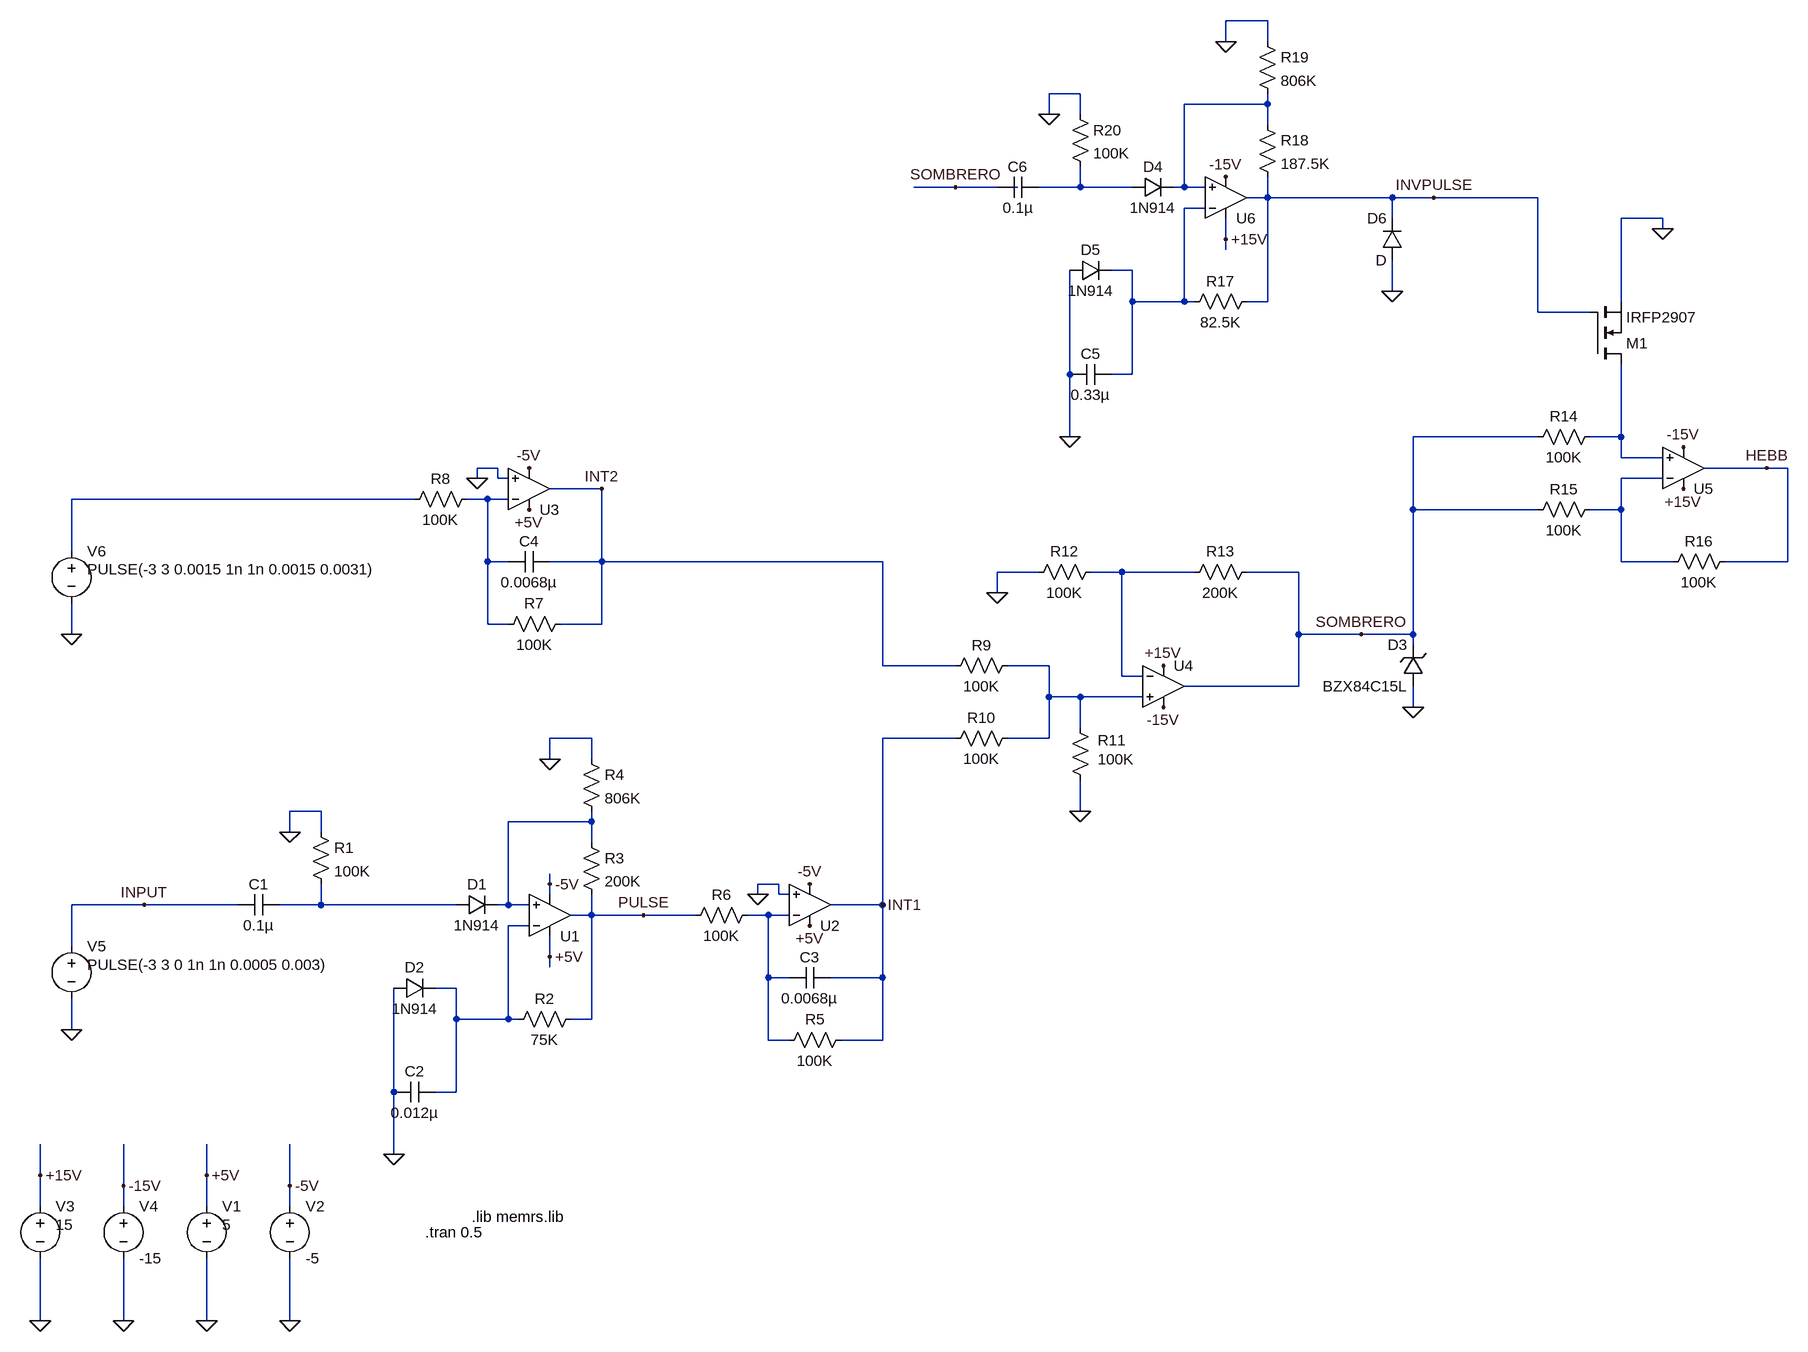
[diagram p0: schematic Main_sch.asc]
Main_sch.asc, the LTspice schematic file:
Version 4
SHEET 1 2292 680
WIRE 1472 -1888 1408 -1888
WIRE 1408 -1856 1408 -1888
WIRE 1472 -1856 1472 -1888
WIRE 1184 -1776 1136 -1776
WIRE 1472 -1760 1472 -1776
WIRE 1472 -1760 1344 -1760
WIRE 1136 -1744 1136 -1776
WIRE 1184 -1744 1184 -1776
WIRE 1472 -1728 1472 -1760
WIRE 992 -1632 928 -1632
WIRE 1056 -1632 992 -1632
WIRE 1088 -1632 1072 -1632
WIRE 1184 -1632 1184 -1664
WIRE 1184 -1632 1120 -1632
WIRE 1264 -1632 1184 -1632
WIRE 1344 -1632 1344 -1760
WIRE 1344 -1632 1328 -1632
WIRE 1376 -1632 1344 -1632
WIRE 1472 -1616 1472 -1648
WIRE 1472 -1616 1440 -1616
WIRE 1664 -1616 1472 -1616
WIRE 1728 -1616 1664 -1616
WIRE 1888 -1616 1728 -1616
WIRE 1376 -1600 1344 -1600
WIRE 1664 -1584 1664 -1616
WIRE 2080 -1584 2016 -1584
WIRE 2080 -1568 2080 -1584
WIRE 1408 -1552 1408 -1584
WIRE 1408 -1536 1408 -1552
WIRE 1264 -1504 1232 -1504
WIRE 1664 -1472 1664 -1520
WIRE 1264 -1456 1264 -1504
WIRE 1344 -1456 1344 -1600
WIRE 1344 -1456 1264 -1456
WIRE 1360 -1456 1344 -1456
WIRE 1472 -1456 1472 -1616
WIRE 1472 -1456 1440 -1456
WIRE 2016 -1456 2016 -1584
WIRE 1888 -1440 1888 -1616
WIRE 1968 -1440 1888 -1440
WIRE 1168 -1344 1168 -1504
WIRE 1264 -1344 1264 -1456
WIRE 1264 -1344 1232 -1344
WIRE 1168 -1248 1168 -1344
WIRE 1888 -1248 1696 -1248
WIRE 2016 -1248 2016 -1360
WIRE 2016 -1248 1968 -1248
WIRE 2016 -1216 2016 -1248
WIRE 2080 -1216 2016 -1216
WIRE 288 -1200 256 -1200
WIRE 2240 -1200 2144 -1200
WIRE 2272 -1200 2240 -1200
WIRE 256 -1184 256 -1200
WIRE 288 -1184 288 -1200
WIRE 304 -1184 288 -1184
WIRE 2080 -1184 2016 -1184
WIRE 448 -1168 368 -1168
WIRE 160 -1152 -368 -1152
WIRE 272 -1152 240 -1152
WIRE 304 -1152 272 -1152
WIRE 1696 -1136 1696 -1248
WIRE 1888 -1136 1696 -1136
WIRE 2016 -1136 2016 -1184
WIRE 2016 -1136 1968 -1136
WIRE -368 -1072 -368 -1152
WIRE 272 -1056 272 -1152
WIRE 304 -1056 272 -1056
WIRE 448 -1056 448 -1168
WIRE 448 -1056 368 -1056
WIRE 880 -1056 448 -1056
WIRE 2016 -1056 2016 -1136
WIRE 2096 -1056 2016 -1056
WIRE 2272 -1056 2272 -1200
WIRE 2272 -1056 2176 -1056
WIRE 1120 -1040 1056 -1040
WIRE 1248 -1040 1200 -1040
WIRE 1360 -1040 1248 -1040
WIRE 1520 -1040 1440 -1040
WIRE 1056 -1008 1056 -1040
WIRE 272 -960 272 -1056
WIRE 304 -960 272 -960
WIRE 448 -960 448 -1056
WIRE 448 -960 384 -960
WIRE -368 -944 -368 -992
WIRE 1520 -944 1520 -1040
WIRE 1616 -944 1520 -944
WIRE 1696 -944 1696 -1136
WIRE 1696 -944 1616 -944
WIRE 1696 -928 1696 -944
WIRE 880 -896 880 -1056
WIRE 992 -896 880 -896
WIRE 1136 -896 1072 -896
WIRE 1248 -880 1248 -1040
WIRE 1280 -880 1248 -880
WIRE 1520 -864 1520 -944
WIRE 1520 -864 1344 -864
WIRE 1136 -848 1136 -896
WIRE 1184 -848 1136 -848
WIRE 1280 -848 1184 -848
WIRE 1696 -832 1696 -864
WIRE 1184 -800 1184 -848
WIRE 432 -784 368 -784
WIRE 992 -784 880 -784
WIRE 1136 -784 1136 -848
WIRE 1136 -784 1072 -784
WIRE 368 -752 368 -784
WIRE 432 -752 432 -784
WIRE 16 -672 -32 -672
WIRE 1184 -672 1184 -720
WIRE 432 -656 432 -672
WIRE 432 -656 304 -656
WIRE -32 -640 -32 -672
WIRE 16 -640 16 -672
WIRE 432 -624 432 -656
WIRE 368 -560 368 -576
WIRE 720 -560 688 -560
WIRE 368 -544 368 -560
WIRE 688 -544 688 -560
WIRE 720 -544 720 -560
WIRE 736 -544 720 -544
WIRE -256 -528 -368 -528
WIRE -112 -528 -256 -528
WIRE 16 -528 16 -560
WIRE 16 -528 -48 -528
WIRE 224 -528 16 -528
WIRE 304 -528 304 -656
WIRE 304 -528 288 -528
WIRE 336 -528 304 -528
WIRE 880 -528 880 -784
WIRE 880 -528 800 -528
WIRE 432 -512 432 -544
WIRE 432 -512 400 -512
WIRE 512 -512 432 -512
WIRE 592 -512 512 -512
WIRE 704 -512 672 -512
WIRE 736 -512 704 -512
WIRE 336 -496 304 -496
WIRE -368 -464 -368 -528
WIRE 368 -448 368 -480
WIRE 368 -432 368 -448
WIRE 704 -416 704 -512
WIRE 736 -416 704 -416
WIRE 880 -416 880 -528
WIRE 880 -416 800 -416
WIRE 224 -400 192 -400
WIRE 224 -352 224 -400
WIRE 304 -352 304 -496
WIRE 304 -352 224 -352
WIRE 320 -352 304 -352
WIRE 432 -352 432 -512
WIRE 432 -352 400 -352
WIRE -368 -336 -368 -384
WIRE 704 -320 704 -416
WIRE 736 -320 704 -320
WIRE 880 -320 880 -416
WIRE 880 -320 816 -320
WIRE 128 -240 128 -400
WIRE 224 -240 224 -352
WIRE 224 -240 192 -240
WIRE 128 -144 128 -240
WIRE -416 -112 -416 -160
WIRE -160 -112 -160 -160
WIRE -288 -96 -288 -160
WIRE -32 -96 -32 -160
WIRE -416 -64 -416 -112
WIRE -288 -64 -288 -96
WIRE -160 -64 -160 -112
WIRE -32 -64 -32 -96
WIRE -416 112 -416 16
WIRE -288 112 -288 16
WIRE -160 112 -160 16
WIRE -32 112 -32 16
FLAG -160 112 0
FLAG -160 -112 +5V
FLAG -32 -96 -5V
FLAG -32 112 0
FLAG 368 -448 +5V
FLAG 368 -560 -5V
FLAG 368 -752 0
FLAG 128 -144 0
FLAG -32 -640 0
FLAG 768 -560 -5V
FLAG 768 -496 +5V
FLAG 688 -544 0
FLAG 880 -528 INT1
FLAG 512 -512 PULSE
FLAG 336 -1200 -5V
FLAG 336 -1136 +5V
FLAG 256 -1184 0
FLAG 448 -1168 INT2
FLAG -416 112 0
FLAG -416 -112 +15V
FLAG -288 -96 -15V
FLAG -288 112 0
FLAG -368 -336 0
FLAG -368 -944 0
FLAG -256 -528 INPUT
FLAG 1312 -832 -15V
FLAG 1312 -896 +15V
FLAG 1184 -672 0
FLAG 1056 -1008 0
FLAG 1616 -944 SOMBRERO
FLAG 1696 -832 0
FLAG 2112 -1232 -15V
FLAG 2112 -1168 +15V
FLAG 2080 -1568 0
FLAG 2240 -1200 HEBB
FLAG 1408 -1552 +15V
FLAG 1408 -1856 0
FLAG 1168 -1248 0
FLAG 992 -1632 SOMBRERO
FLAG 1136 -1744 0
FLAG 1408 -1648 -15V
FLAG 1728 -1616 INVPULSE
FLAG 1664 -1472 0
SYMBOL voltage -160 -80 R0
WINDOW 3 24 44 Left 2
WINDOW 123 0 0 Left 2
WINDOW 39 0 0 Left 2
SYMATTR Value 5
SYMATTR InstName V1
SYMBOL voltage -32 -80 R0
WINDOW 123 0 0 Left 2
WINDOW 39 0 0 Left 2
SYMATTR InstName V2
SYMATTR Value -5
SYMBOL Opamps\\UniversalOpamp2 368 -512 M180
SYMATTR InstName U1
SYMBOL cap -48 -544 R90
WINDOW 0 0 32 VBottom 2
WINDOW 3 32 32 VTop 2
SYMATTR InstName C1
SYMATTR Value 0.1µ
SYMATTR SpiceLine V=25 Irms=0 Rser=0.017282 Lser=350p mfg="Würth Elektronik" pn="885012207072 WCAP-CSGP 0805" type="X7R"
SYMBOL cap 192 -256 R90
WINDOW 0 0 32 VBottom 2
WINDOW 3 32 32 VTop 2
SYMATTR InstName C2
SYMATTR Value 0.012µ
SYMATTR SpiceLine V=25 Irms=332m Rser=0.302696 Lser=0 mfg="KEMET" pn="C0805F123K3RAC" type="X7R"
SYMBOL res 0 -656 R0
SYMATTR InstName R1
SYMATTR Value 100K
SYMATTR SpiceLine tol=1 pwr=0.1
SYMBOL res 416 -368 R90
WINDOW 0 0 56 VBottom 2
WINDOW 3 32 56 VTop 2
SYMATTR InstName R2
SYMATTR Value 75K
SYMATTR SpiceLine tol=1 pwr=0.1
SYMBOL res 416 -640 R0
SYMATTR InstName R3
SYMATTR Value 200K
SYMATTR SpiceLine tol=1 pwr=0.1
SYMBOL res 416 -768 R0
SYMATTR InstName R4
SYMATTR Value 806K
SYMATTR SpiceLine tol=1 pwr=0.1
SYMBOL diode 224 -512 R270
WINDOW 0 32 32 VTop 2
WINDOW 3 0 32 VBottom 2
SYMATTR InstName D1
SYMATTR Value 1N914
SYMBOL diode 128 -384 R270
WINDOW 0 32 32 VTop 2
WINDOW 3 0 32 VBottom 2
SYMATTR InstName D2
SYMATTR Value 1N914
SYMBOL Opamps\\UniversalOpamp2 768 -528 M180
SYMATTR InstName U2
SYMBOL cap 800 -432 R90
WINDOW 0 0 32 VBottom 2
WINDOW 3 32 32 VTop 2
SYMATTR InstName C3
SYMATTR Value 0.0068µ
SYMATTR SpiceLine V=25 Irms=0 Rser=0.0165691 Lser=256.21p mfg="Würth Elektronik" pn="885012009005 WCAP-CSGP 1210" type="NP0"
SYMBOL res 832 -336 R90
WINDOW 0 0 56 VBottom 2
WINDOW 3 32 56 VTop 2
SYMATTR InstName R5
SYMATTR Value 100K
SYMATTR SpiceLine tol=1 pwr=0.1
SYMBOL res 688 -528 R90
WINDOW 0 0 56 VBottom 2
WINDOW 3 32 56 VTop 2
SYMATTR InstName R6
SYMATTR Value 100K
SYMATTR SpiceLine tol=1 pwr=0.1
SYMBOL Opamps\\UniversalOpamp2 336 -1168 M180
SYMATTR InstName U3
SYMBOL cap 368 -1072 R90
WINDOW 0 0 32 VBottom 2
WINDOW 3 32 32 VTop 2
SYMATTR InstName C4
SYMATTR Value 0.0068µ
SYMATTR SpiceLine V=25 Irms=0 Rser=0.0165691 Lser=256.21p mfg="Würth Elektronik" pn="885012009005 WCAP-CSGP 1210" type="NP0"
SYMBOL res 400 -976 R90
WINDOW 0 0 56 VBottom 2
WINDOW 3 32 56 VTop 2
SYMATTR InstName R7
SYMATTR Value 100K
SYMATTR SpiceLine tol=1 pwr=0.1
SYMBOL res 256 -1168 R90
WINDOW 0 0 56 VBottom 2
WINDOW 3 32 56 VTop 2
SYMATTR InstName R8
SYMATTR Value 100K
SYMATTR SpiceLine tol=1 pwr=0.1
SYMBOL voltage -416 -80 R0
WINDOW 3 24 44 Left 2
WINDOW 123 0 0 Left 2
WINDOW 39 0 0 Left 2
SYMATTR Value 15
SYMATTR InstName V3
SYMBOL voltage -288 -80 R0
WINDOW 123 0 0 Left 2
WINDOW 39 0 0 Left 2
SYMATTR InstName V4
SYMATTR Value -15
SYMBOL voltage -368 -480 R0
WINDOW 3 24 44 Left 2
WINDOW 123 0 0 Left 2
WINDOW 39 0 0 Left 2
SYMATTR Value PULSE(-3 3 0 1n 1n 0.0005 0.003)
SYMATTR InstName V5
SYMBOL voltage -368 -1088 R0
WINDOW 3 24 44 Left 2
WINDOW 123 0 0 Left 2
WINDOW 39 0 0 Left 2
SYMATTR Value PULSE(-3 3 0.0015 1n 1n 0.0015 0.0031)
SYMATTR InstName V6
SYMBOL Opamps\\UniversalOpamp2 1312 -864 R0
SYMATTR InstName U4
SYMBOL res 1088 -912 R90
WINDOW 0 0 56 VBottom 2
WINDOW 3 32 56 VTop 2
SYMATTR InstName R9
SYMATTR Value 100K
SYMATTR SpiceLine tol=1 pwr=0.1
SYMBOL res 1088 -800 R90
WINDOW 0 0 56 VBottom 2
WINDOW 3 32 56 VTop 2
SYMATTR InstName R10
SYMATTR Value 100K
SYMATTR SpiceLine tol=1 pwr=0.1
SYMBOL res 1200 -704 R180
WINDOW 0 -55 77 Left 2
WINDOW 3 -67 48 Left 2
SYMATTR InstName R11
SYMATTR Value 100K
SYMATTR SpiceLine tol=1 pwr=0.1
SYMBOL res 1104 -1024 R270
WINDOW 0 32 56 VTop 2
WINDOW 3 0 56 VBottom 2
SYMATTR InstName R12
SYMATTR Value 100K
SYMATTR SpiceLine tol=1 pwr=0.1
SYMBOL res 1344 -1024 R270
WINDOW 0 32 56 VTop 2
WINDOW 3 0 56 VBottom 2
SYMATTR InstName R13
SYMATTR Value 200K
SYMATTR SpiceLine tol=1 pwr=0.1
SYMBOL zener 1712 -864 R180
WINDOW 0 24 64 Left 2
WINDOW 3 24 0 Left 2
SYMATTR InstName D3
SYMATTR Value BZX84C15L
SYMBOL Opamps\\UniversalOpamp2 2112 -1200 M180
SYMATTR InstName U5
SYMBOL res 1872 -1232 R270
WINDOW 0 32 56 VTop 2
WINDOW 3 0 56 VBottom 2
SYMATTR InstName R14
SYMATTR Value 100K
SYMATTR SpiceLine tol=1 pwr=0.1
SYMBOL res 1872 -1120 R270
WINDOW 0 32 56 VTop 2
WINDOW 3 0 56 VBottom 2
SYMATTR InstName R15
SYMATTR Value 100K
SYMATTR SpiceLine tol=1 pwr=0.1
SYMBOL res 2080 -1040 R270
WINDOW 0 32 56 VTop 2
WINDOW 3 0 56 VBottom 2
SYMATTR InstName R16
SYMATTR Value 100K
SYMATTR SpiceLine tol=1 pwr=0.1
SYMBOL nmos 1968 -1360 M180
SYMATTR InstName M1
SYMATTR Value IRFP2907
SYMBOL Opamps\\UniversalOpamp2 1408 -1616 M180
SYMATTR InstName U6
SYMBOL cap 1232 -1360 R90
WINDOW 0 0 32 VBottom 2
WINDOW 3 32 32 VTop 2
SYMATTR InstName C5
SYMATTR Value 0.33µ
SYMATTR SpiceLine V=25 Irms=332m Rser=0.302696 Lser=0
SYMBOL res 1456 -1472 R90
WINDOW 0 0 56 VBottom 2
WINDOW 3 32 56 VTop 2
SYMATTR InstName R17
SYMATTR Value 82.5K
SYMATTR SpiceLine tol=1 pwr=0.1
SYMBOL res 1456 -1744 R0
SYMATTR InstName R18
SYMATTR Value 187.5K
SYMATTR SpiceLine tol=1 pwr=0.1
SYMBOL res 1456 -1872 R0
SYMATTR InstName R19
SYMATTR Value 806K
SYMATTR SpiceLine tol=1 pwr=0.1
SYMBOL diode 1264 -1616 R270
WINDOW 0 32 32 VTop 2
WINDOW 3 0 32 VBottom 2
SYMATTR InstName D4
SYMATTR Value 1N914
SYMBOL diode 1168 -1488 R270
WINDOW 0 32 32 VTop 2
WINDOW 3 0 32 VBottom 2
SYMATTR InstName D5
SYMATTR Value 1N914
SYMBOL cap 1120 -1648 R90
WINDOW 0 0 32 VBottom 2
WINDOW 3 32 32 VTop 2
SYMATTR InstName C6
SYMATTR Value 0.1µ
SYMATTR SpiceLine V=25 Irms=0 Rser=0.017282 Lser=350p mfg="Würth Elektronik" pn="885012207072 WCAP-CSGP 0805" type="X7R"
SYMBOL res 1168 -1760 R0
SYMATTR InstName R20
SYMATTR Value 100K
SYMATTR SpiceLine tol=1 pwr=0.1
SYMBOL diode 1680 -1520 R180
WINDOW 0 24 64 Left 2
WINDOW 3 24 0 Left 2
SYMATTR InstName D6
TEXT 248 -48 Left 2 !.lib memrs.lib
TEXT 176 -24 Left 2 !.tran 0.5

The netlist it stands for:
* Main_sch.asc
V1 +5V 0 5
V2 -5V 0 -5
XU1 N011 N014 +5V -5V PULSE level.2 Avol=1Meg GBW=10Meg Slew=10Meg ilimit=25m rail=0 Vos=0 phimargin=45 en=0 enk=0 in=0 ink=0 Rin=500Meg  ; pins IN+ IN- V+ V- OUT
C1 N012 INPUT 0.1µ V=25 Irms=0 Rser=0.017282 Lser=350p mfg="Würth Elektronik" pn="885012207072 WCAP-CSGP 0805" type="X7R"
C2 N014 0 0.012µ V=25 Irms=332m Rser=0.302696 Lser=0 mfg="KEMET" pn="C0805F123K3RAC" type="X7R"
R1 0 N012 100K tol=1 pwr=0.1
R2 PULSE N014 75K tol=1 pwr=0.1
R3 N011 PULSE 200K tol=1 pwr=0.1
R4 0 N011 806K tol=1 pwr=0.1
D1 N012 N011 1N914
D2 0 N014 1N914
XU2 0 N013 +5V -5V INT1 level.2 Avol=1Meg GBW=10Meg Slew=10Meg ilimit=25m rail=0 Vos=0 phimargin=45 en=0 enk=0 in=0 ink=0 Rin=500Meg  ; pins IN+ IN- V+ V- OUT
C3 INT1 N013 0.0068µ V=25 Irms=0 Rser=0.0165691 Lser=256.21p mfg="Würth Elektronik" pn="885012009005 WCAP-CSGP 1210" type="NP0"
R5 INT1 N013 100K tol=1 pwr=0.1
R6 N013 PULSE 100K tol=1 pwr=0.1
XU3 0 N008 +5V -5V INT2 level.2 Avol=1Meg GBW=10Meg Slew=10Meg ilimit=25m rail=0 Vos=0 phimargin=45 en=0 enk=0 in=0 ink=0 Rin=500Meg  ; pins IN+ IN- V+ V- OUT
C4 INT2 N008 0.0068µ V=25 Irms=0 Rser=0.0165691 Lser=256.21p mfg="Würth Elektronik" pn="885012009005 WCAP-CSGP 1210" type="NP0"
R7 INT2 N008 100K tol=1 pwr=0.1
R8 N008 N007 100K tol=1 pwr=0.1
V3 +15V 0 15
V4 -15V 0 -15
V5 INPUT 0 PULSE(-3 3 0 1n 1n 0.0005 0.003)
V6 N007 0 PULSE(-3 3 0.0015 1n 1n 0.0015 0.0031)
XU4 N010 N009 +15V -15V SOMBRERO level.2 Avol=1Meg GBW=10Meg Slew=10Meg ilimit=25m rail=0 Vos=0 phimargin=45 en=0 enk=0 in=0 ink=0 Rin=500Meg  ; pins IN+ IN- V+ V- OUT
R9 N010 INT2 100K tol=1 pwr=0.1
R10 N010 INT1 100K tol=1 pwr=0.1
R11 0 N010 100K tol=1 pwr=0.1
R12 0 N009 100K tol=1 pwr=0.1
R13 N009 SOMBRERO 200K tol=1 pwr=0.1
D3 0 SOMBRERO BZX84C15L
XU5 N005 N006 +15V -15V HEBB level.2 Avol=1Meg GBW=10Meg Slew=10Meg ilimit=25m rail=0 Vos=0 phimargin=45 en=0 enk=0 in=0 ink=0 Rin=500Meg  ; pins IN+ IN- V+ V- OUT
R14 SOMBRERO N005 100K tol=1 pwr=0.1
R15 SOMBRERO N006 100K tol=1 pwr=0.1
R16 N006 HEBB 100K tol=1 pwr=0.1
M1 N005 INVPULSE 0 0 IRFP2907
XU6 N001 N004 +15V -15V INVPULSE level.2 Avol=1Meg GBW=10Meg Slew=10Meg ilimit=25m rail=0 Vos=0 phimargin=45 en=0 enk=0 in=0 ink=0 Rin=500Meg  ; pins IN+ IN- V+ V- OUT
C5 N004 0 0.33µ V=25 Irms=332m Rser=0.302696 Lser=0
R17 INVPULSE N004 82.5K tol=1 pwr=0.1
R18 N001 INVPULSE 187.5K tol=1 pwr=0.1
R19 0 N001 806K tol=1 pwr=0.1
D4 N003 N001 1N914
D5 0 N004 1N914
C6 N003 SOMBRERO 0.1µ V=25 Irms=0 Rser=0.017282 Lser=350p mfg="Würth Elektronik" pn="885012207072 WCAP-CSGP 0805" type="X7R"
R20 0 N003 100K tol=1 pwr=0.1
D6 0 INVPULSE D
.model D D
.lib standard.dio
.model NMOS NMOS
.model PMOS PMOS
.lib standard.mos
.lib memrs.lib
.tran 0.5
.lib UniversalOpamps2.sub
.backanno
.end